# Altium schematic sheet main.SchDoc
size A4; SheetNumber: 1; SheetTotal: 4
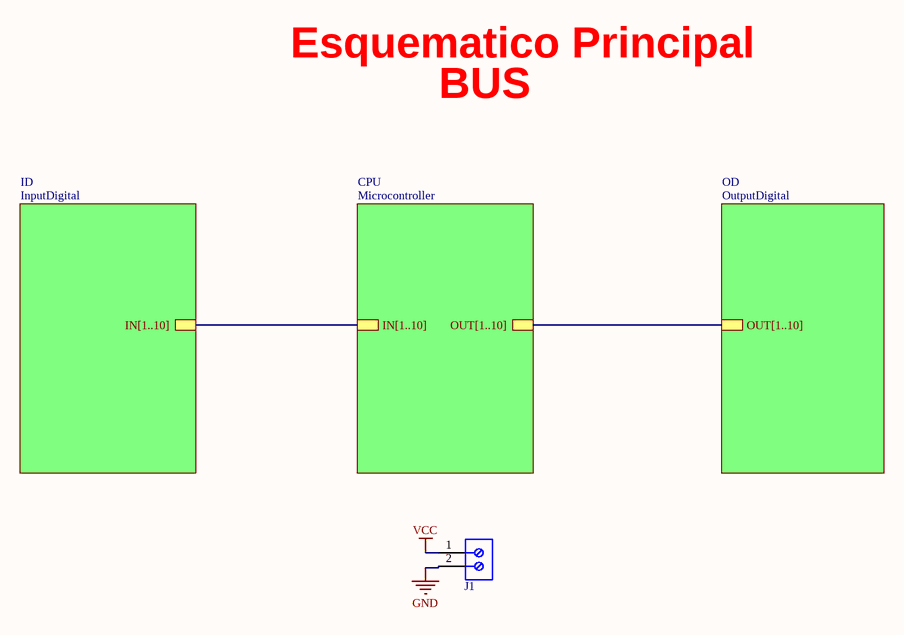
[diagram p0: main.SchDoc]

## Parts
J1  691214110002  [691214110002]  (value not drawn)

## Sub-sheets
CPU = Microcontroller: IN[1..10], OUT[1..10]
ID = InputDigital: IN[1..10]
OD = OutputDigital: OUT[1..10]

## Nets
GND: J1.2
VCC: J1.1

## Buses and harness runs
bus sheet CPU/IN[1..10] = sheet ID/IN[1..10]
bus sheet CPU/OUT[1..10] = sheet OD/OUT[1..10]

## Notes on the sheet
- Esquematico Principal
- BUS

## Library data of the parts
J1 = CMP-1502-02464-1: Serie 2141 - 3.50 mm Horizontal Entry Modular with Rising Cage Clamp WR-TBL, 2 pin; Manufacturer: Wurth Elektronik; Pin Number: 2; Pitch: 3.50mm; Datasheet URL: http://katalog.we-online.de/em/datasheet/6912141100xx.pdf; Packaging: Box; Mounting Technology: THT; Package Reference: 691214110002; Manufacturer URL: http://www.we-online.de; Part Number: 691214110002; Publisher: WurthElektronik; Operating Temperature: -40to105degC